# EAGLE design Nucleo_Mouse_SensorBoard_v2 (EAGLE 9.4.2)
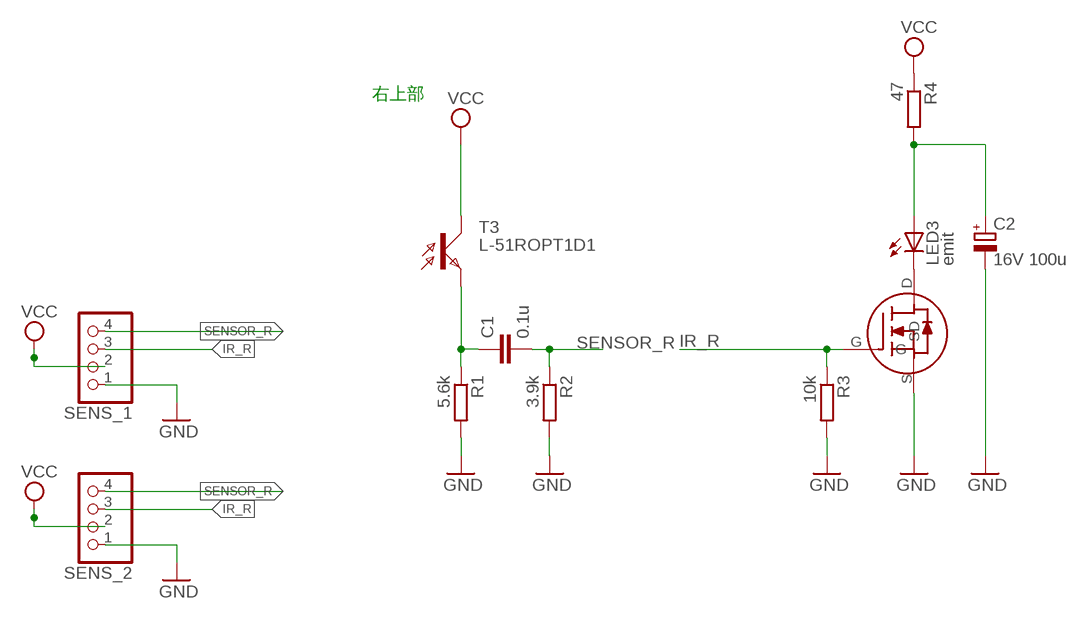
[diagram p0: schematic, sheet 1]

## Parts
2N2  2N7000  [2N7000]
C1  0.1u  C2,5-3  [C2.5-3]
C2  16V 100u  CPOL-EUE2-4  [E2-4]
LED3  emit  LED5MM  [LED5MM]
R1  5.6k  R-EU_0204/7  [0204/7]
R2  3.9k  R-EU_0204/7  [0204/7]
R3  10k  R-EU_0204/7  [0204/7]
R4  47  R-EU_0204/7  [0204/7]
SENS_1  TP-1X4  [1X04]
SENS_2  TP-1X4  [1X04]
T3  L-51ROPT1D1  [L-51ROPT1D1]

## Nets
GND: 2N2.S C2.- R1.2 R2.2 R3.2 SENS_1.1 SENS_2.1
IR_R: 2N2.G R3.1 SENS_1.3 SENS_2.3
N$9: C2.+ LED3.A R4.2
N$11: 2N2.D LED3.K(C)
N$12: C1.1 R1.1 T3.EMITTER(E)
SENSOR_R: C1.2 R2.1 SENS_1.4 SENS_2.4
VCC: R4.1 SENS_1.2 SENS_2.2 T3.COLLECTOR(C)

## Notes on the sheet
- 右上部

## Library data of the parts
2N2 = 2n7000:2N7000
C1 = capacitor-wima:C: CAPACITOR naming: grid - package width
C2 = rcl:CPOL-EU: POLARIZED CAPACITOR, European symbol; SPICEPREFIX: C
LED3 = MicroMouseYR:LED: LEDs Standard schematic elements and footprints for 5mm, 3mm, 1206, and 0603 sized LEDs. 5mm - Spark Fun Electronics SKU : COM-00529 (and others)
R1-R4 = MicroMouseYR:R-EU_: RESISTOR, European symbol
SENS_1 SENS_2 = pad:TP-1X4
T3 = lightsensor:L-51ROPT1D1

## Board
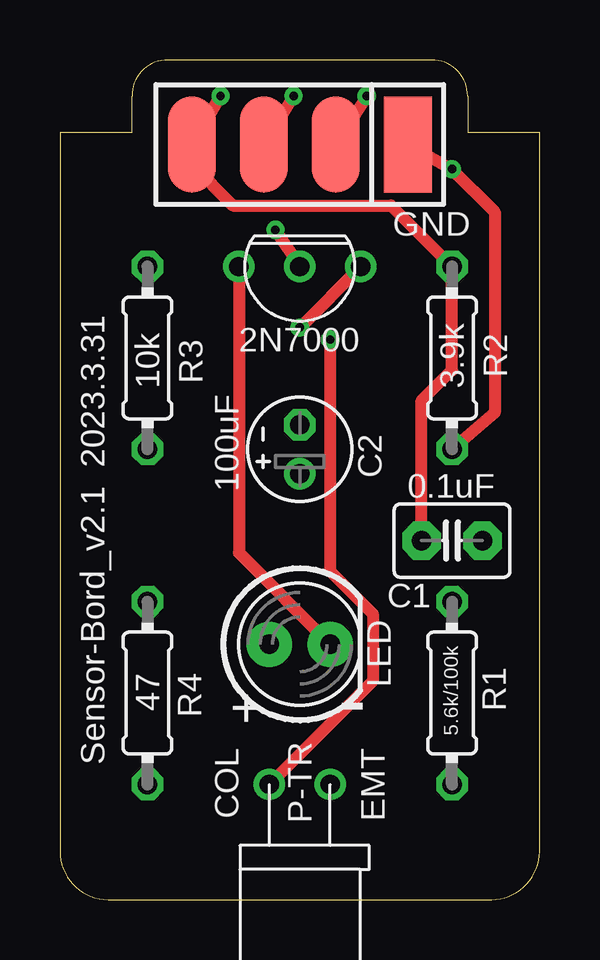
[diagram p1: board, top side]
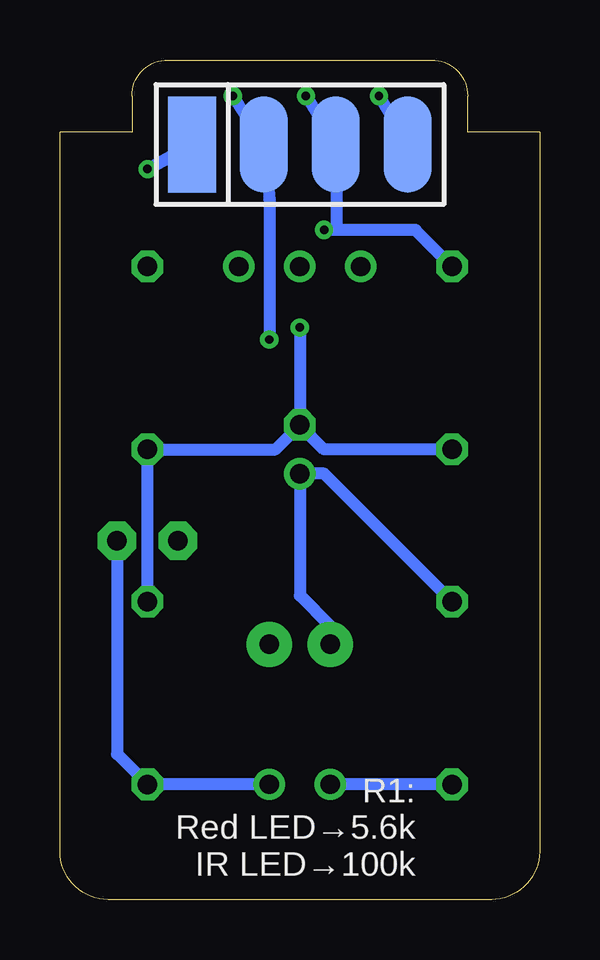
[diagram p2: board, bottom side, seen from below]

Size 20 x 35 mm. Coordinates in mm from the lower left corner, seen from the top.
Outline: 20,2 20,32 17,32 17,33.5 arc90 15.5,35 4.5,35 arc90 3,33.5 3,32 0,32 0,2 arc90 2,0 18,0 arc90 20,2
Copper layers (1*16): Top 0.035mm / dielectric 1.5mm / Bottom 0.035mm
Design rules "default *": minimum track width 6mil, minimum drill 0.35mm, track to track 6mil, track to pad 6mil, pad to pad 6mil, via to via 6mil, smd to smd 6mil, copper to edge 40mil, drill to drill 6mil, minimum pad ring 10mil, minimum via ring 8mil, stop-mask expansion 4mil, vias tented up to drill 30mil, thermal gap 10mil

### Footprints (pad centres in the part's own frame; a part is rotated, then mirrored left to right if it is on the bottom)
2N7000 = drill 0.8: D 2.54,0; G 0,0; S -2.54,0
C2.5-3 = drill 0.813 pad 1.6 octagon: 1 -1.27,0; 2 1.27,0
E2-4 = drill 0.813 pad 1.27: + -1.016,0 | drill 0.813 pad 1.27 octagon: - 1.016,0
LED5MM = drill 0.813 pad 1.88: A -1.27,0; K 1.27,0
0204/7 = drill 0.813 octagon: 1 -3.81,0; 2 3.81,0
1X04 = smd 2 x 4: 1 -4.5,0; 2 -1.5,0; 3 1.5,0; 4 4.5,0
L-51ROPT1D1 = drill 0.8: COLLECTOR 2.54,1.27; EMITTER 2.54,-1.27

### Placement (x,y rotation side)
2N2  10,26.39 180 top
C1  16.35,14.96 180 top
C2  10,18.77 90 top
LED3  10,10.64 0 top
R1  16.35,8.61 90 top
R2  16.35,22.58 270 top
R3  3.65,22.58 270 top
R4  3.65,8.61 90 top
SENS_1  10,31.47 0 bottom
SENS_2  10,31.47 180 top
T3  10,2.26 90 top

### Tracks (layer width: path | path; a pad name or v marks a point on that pad's centre or on a via)
GND  (via drill 0.35)
  Top 0.508: SENS_2.1 v16.35,30.45 18.13,28.68 18.13,20.29 R2.2 | 2N2.S v10,23.85
  Bottom 0.508: v16.35,30.45 SENS_2.1 | R1.2 R2.2 11.02,18.77 C2.- | C2.- 8.98,18.77 R3.2 | v10,23.85 C2.-
IR_R  (via drill 0.35)
  Top 0.508: v9.75,33.5 SENS_2.3 | v8.98,27.91 2N2.G
  Bottom 0.508: v9.75,33.5 SENS_2.3 8.48,27.91 | R3.1 5.17,27.91 8.48,27.91 | 8.48,27.91 v8.98,27.91
N$9
  Bottom 0.508: LED3.A 8.73,11.4 10,12.67 C2.+ 8.98,17.75 R4.2
N$11
  Top 0.508: 2N2.D 7.46,14.45 LED3.K
N$12
  Bottom 0.508: T3.EMITTER R1.1 17.62,6.07 C1.1
SENSOR_R  (via drill 0.35)
  Top 0.305: SENS_2.4 5.53,31.2
  Top 0.508: v6.7,33.5 SENS_2.4 5.5,30.64 7.21,28.93 13.81,28.93 R2.1 16.35,22.07 15.08,20.8 C1.2
  Bottom 0.508: v6.7,33.5 SENS_2.4
VCC  (via drill 0.35)
  Top 0.508: v12.79,33.5 SENS_2.2 | v11.27,23.34 11.27,13.69 13.05,11.91 13.05,9.12 T3.COLLECTOR
  Bottom 0.508: R4.1 T3.COLLECTOR | v11.27,23.34 11.27,29.18 SENS_2.2 v12.79,33.5

### Text on the board
tPlace: GND | Sensor-Bord_v2.1 2023.3.31 | 2N7000 | 10k | 100uF | 3.9k | 0.1uF | LED | - | + | 47 | COL | P-TR | EMT | 5.6k/100k
bPlace: R1: / Red LED→5.6k / IR LED→100k